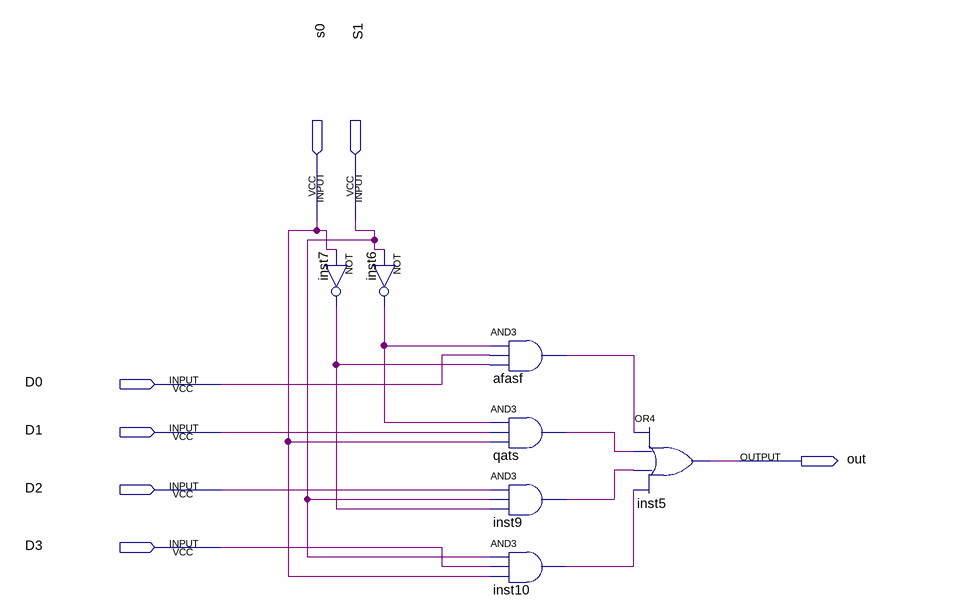
[diagram p0: schematic sheet]
// Quartus schematic Four_to_one_MUX.bdf as structural Verilog: 7 symbols, 7 pins
module Four_to_one_MUX (
  input  s0,
  input  S1,
  input  D0,
  input  D1,
  input  D2,
  input  D3,
  output out
);

  wire afasf_out, inst6_out, inst7_out, inst9_out, inst10_out, qats_out;

  not inst7 (inst7_out, s0);
  not inst6 (inst6_out, S1);
  and afasf (afasf_out, inst6_out, D0, inst7_out);
  and qats (qats_out, inst6_out, D1, s0);
  and inst9 (inst9_out, D2, S1, inst7_out);
  and inst10 (inst10_out, S1, D3, s0);
  or inst5 (out, afasf_out, qats_out, inst9_out, inst10_out);
endmodule
